# Altium project Filter-Stereo.PrjPcb
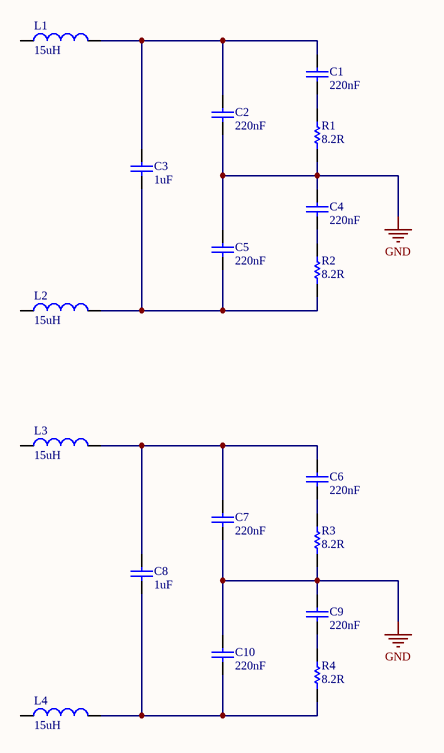
[diagram p0: Filter-Stereo.SchDoc]
1 sheet, 18 parts. Net scope: global (net labels, ports and power ports of the same name join across sheets).

## Sheet Filter-Stereo.SchDoc
size A3

### Parts
C1  220nF  [CAP_RM15_W5L18]
C2  220nF  [CAP_RM15_W5L18]
C3  value 1uF  [CAP_RM5_W7.8L7.8H13]  (hidden comment: 1uF/±5%/PET)
C4  220nF  [CAP_RM15_W5L18]
C5  220nF  [CAP_RM15_W5L18]
C6  220nF  [CAP_RM15_W5L18]
C7  220nF  [CAP_RM15_W5L18]
C8  value 1uF  [CAP_RM5_W7.8L7.8H13]  (hidden comment: 1uF/±5%/PET)
C9  220nF  [CAP_RM15_W5L18]
C10  220nF  [CAP_RM15_W5L18]
L1  value 15uH  [1D14A]  (hidden comment: 1D14A-150m)
L2  value 15uH  [1D14A]  (hidden comment: 1D14A-150m)
L3  value 15uH  [1D14A]  (hidden comment: 1D14A-150m)
L4  value 15uH  [1D14A]  (hidden comment: 1D14A-150m)
R1  value 8.2R  [RESC1020]  (hidden comment: RES SMD 8.2 OHM 2W 2010 WIDE)
R2  value 8.2R  [RESC1020]  (hidden comment: RES SMD 8.2 OHM 2W 2010 WIDE)
R3  value 8.2R  [RESC1020]  (hidden comment: RES SMD 8.2 OHM 2W 2010 WIDE)
R4  value 8.2R  [RESC1020]  (hidden comment: RES SMD 8.2 OHM 2W 2010 WIDE)

### Nets
GND: C2.1 C4.2 C5.2 C7.1 C9.2 C10.2 R1.1 R3.1
NetC1_1: C1.1 R1.2
NetC1_2: C1.2 C2.2 C3.2 L1.2
NetC3_1: C3.1 C5.1 L2.2 R2.1
NetC4_1: C4.1 R2.2
NetC6_1: C6.1 R3.2
NetC6_2: C6.2 C7.2 C8.2 L3.2
NetC8_1: C8.1 C10.1 L4.2 R4.1
NetC9_1: C9.1 R4.2

Not connected (* = marked no-connect by the designer): L1 1; L2 1; L3 1; L4 1

### Library data of the parts
C1 C2 C4-C7 C9 C10 = CAP_B32529 _220nF: CAP FILM 0.22UF 5% 100VDC RADIAL; MPN: B32529C1224J289; Farnell: 2797826; DigiKey: 495-4875-3-ND; Tolerance: 5%; Value: 220nF
C3 C8 = CAP_B32529 _1uF: CAP FILM 1UF 5% 100VDC RADIAL; MPN: B32529D1105J289; Farnell: 2797848; DigiKey: 495-4875-3-ND; Tolerance: 5%
L1-L4 = L_1D14A-150m: Fixed Inductors Class D Inductor 15uH 16mOhms; MPN: 1D14A-150M; Mouser: 911-1D14A-150M
R1-R4 = RES_ERJ-B1BJ8R2U: 8.2 Ohms ±5% 2W Chip Resistor Wide 2010 (5025 Metric), 1020 Automotive AEC-Q200, Current Sense Thick Film; Tolerance: ±5%; DigiKey: ERJ-B1BJ8R2U-ND; Farnell: 2294027; Power: 2W; MPN: ERJ-B1BJ8R2U